# EAGLE design BMCOP V1.2 (EAGLE 8.6.0)
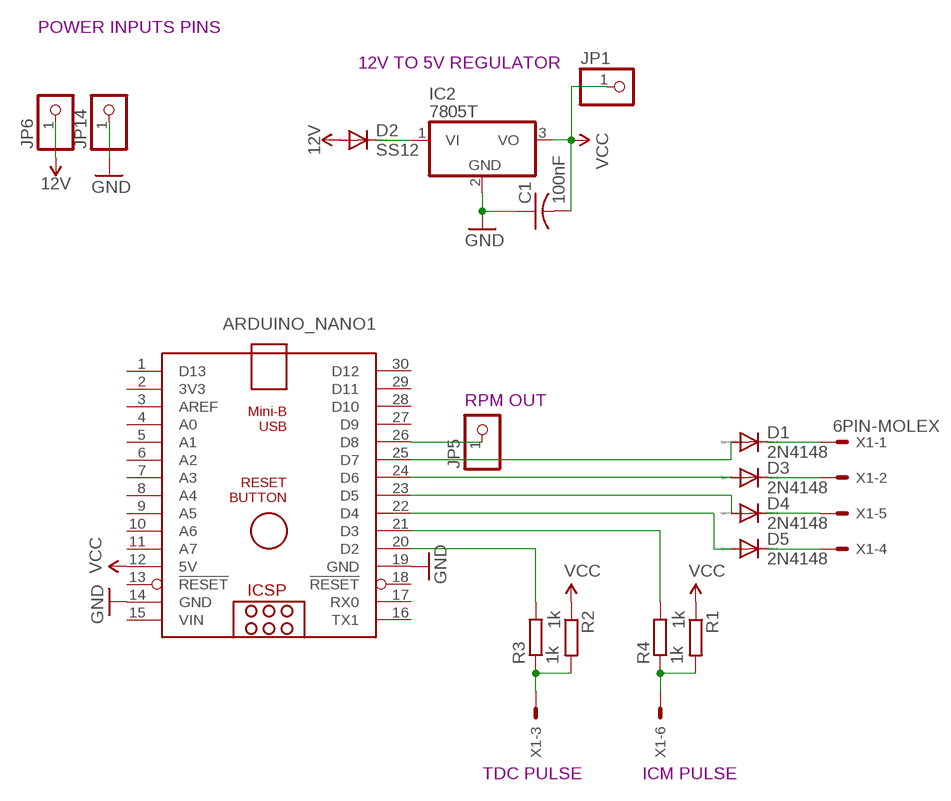
[diagram p0: schematic, sheet 1]

## Parts
ARDUINO_NANO1  ARDUINO_NANO  [ARDUINO_NANO]
C1  100nF  C-US025-024X044  [C025-024X044]
D1  2N4148  DIODE-D-7.5  [D-7.5]
D2  SS12  DIODE-D-7.5  [D-7.5]
D3  2N4148  DIODE-D-7.5  [D-7.5]
D4  2N4148  DIODE-D-7.5  [D-7.5]
D5  2N4148  DIODE-D-7.5  [D-7.5]
IC2  7805T  [TO220H]
JP1  PINHD-1X1  [1X01]
JP5  PINHD-1X1  [1X01]
JP6  PINHD-1X1  [1X01]
JP14  PINHD-1X1  [1X01]
R1  1k  R-EU_0204/7  [0204/7]
R2  1k  R-EU_0204/7  [0204/7]
R3  1k  R-EU_0204/7  [0204/7]
R4  1k  R-EU_0204/7  [0204/7]
X1  6PIN-MOLEX  [6PIN-MOLEX]

## Nets
12V: D2.A JP6.1
GND: ARDUINO_NANO1.14(GND) ARDUINO_NANO1.19(GND) C1.1 IC2.2(GND) JP14.1
N$1: ARDUINO_NANO1.25(D7) D1.A
N$2: ARDUINO_NANO1.24(D6) D3.A
N$3: ARDUINO_NANO1.23(D5) D4.A
N$4: ARDUINO_NANO1.22(D4) D5.A
N$5: D2.C IC2.1(VI)
N$8: ARDUINO_NANO1.26(D8) JP5.1
N$10: R1.2 R4.1 X1.6
N$11: ARDUINO_NANO1.21(D3) R4.2
N$14: ARDUINO_NANO1.20(D2) R3.2
N$21: D4.C X1.5
N$25: D1.C X1.1
N$26: D3.C X1.2
N$29: R2.2 R3.1 X1.3
N$31: D5.C X1.4
VCC: ARDUINO_NANO1.12(5V) C1.2 IC2.3(VO) JP1.1 R1.1 R2.1
Unconnected: ARDUINO_NANO1.1(D13) ARDUINO_NANO1.2(3V3) ARDUINO_NANO1.3(AREF) ARDUINO_NANO1.4(A0) ARDUINO_NANO1.5(A1) ARDUINO_NANO1.6(A2) ARDUINO_NANO1.7(A3) ARDUINO_NANO1.8(A4) ARDUINO_NANO1.9(A5) ARDUINO_NANO1.10(A6) ARDUINO_NANO1.11(A7) ARDUINO_NANO1.13(!RESET) ARDUINO_NANO1.16(TX1) ARDUINO_NANO1.17(RX0) ARDUINO_NANO1.18(!RESET) ARDUINO_NANO1.27(D9) ARDUINO_NANO1.28(D10) ARDUINO_NANO1.29(D11) ARDUINO_NANO1.30(D12)

## Notes on the sheet
- POWER INPUTS PINS
- 12V TO 5V REGULATOR
- RPM OUT
- TDC PULSE | ICM PULSE

## Power pins joined to a net without a drawn wire
VIN: ARDUINO_NANO1.15(VIN)

## Library data of the parts
ARDUINO_NANO1 = ArduinoNanoV30:ARDUINO_NANO: Arduino Nano V3.0 Overview: The Arduino Nano is a small, complete, and breadboard-friendly board based on the ATmega328 (Arduino Nano 3.x) or ATmega168 (Arduino Nano 2.x). It has more or less the same functionality of the Arduino Duemilanove, but in a different package. It lacks only a DC power jack, and works with a Mini-B USB cable instead of a standard one. The Nano was designed and is being produced by Gravitech. Specifications: Microcontroller Atmel ATmega168 or ATmega328 Operating Voltage (logic level) 5 V Input Voltage (recommended) 7-12 V Input Voltage (limits) 6-20 V Digital I/O Pins 14 (of which 6 provide PWM output) Analog Input Pins 8 DC Current per I/O Pin 40 mA Flash Memory 16 KB (ATmega168) or 32 KB (ATmega328) of which 2 KB used by bootloader SRAM 1 KB (ATmega168) or 2 KB (ATmega328) EEPROM 512 bytes (ATmega168) or 1 KB (ATmega328) Clock Speed 16 MHz Dimensions 0.73" x 1.70" Length 45 mm Width 18 mm Weigth 5 g Power: The Arduino Nano can be powered via the Mini-B USB connection, 6-20V unregulated external power supply (pin 30), or 5V regulated external power supply (pin 27). The power source is automatically selected to the highest voltage source. Memory: The ATmega168 has 16 KB of flash memory for storing code (of which 2 KB is used for the bootloader); the ATmega328 has 32 KB, (also with 2 KB used for the bootloader). The ATmega168 has 1 KB of SRAM and 512 bytes of EEPROM (which can be read and written with the EEPROM library); the ATmega328 has 2 KB of SRAM and 1 KB of EEPROM. Input and Output: Each of the 14 digital pins on the Nano can be used as an input or output, using pinMode(), digitalWrite(), and digitalRead() functions. They operate at 5 volts. Each pin can provide or receive a maximum of 40 mA and has an internal pull-up resistor (disconnected by default) of 20-50 kOhms. In addition, some pins have specialized functions. Visit Arduino - ArduinoBoardNano <https://www.arduino.cc/en/Main/ArduinoBoardNano>
C1 = resistor:C-US: CAPACITOR, American symbol
D1-D5 = diode:DIODE-: DIODE
IC2 = linear:78*: Positive VOLTAGE REGULATOR Source: http://cache.national.com/ds/LM/LM78L05.pdf http://www.fairchildsemi.com/ds/LM/LM7805.pdf
JP1 JP5 JP6 JP14 = pinhead_MOD:PINHD-1X1: PIN HEADER
R1-R4 = resistor:R-EU_: RESISTOR, European symbol
X1 = molex-custom:6PIN-MOLEX: Mini FIT connector 6 pol Source: http://www.molex.com

## Net classes
3 usbvcc: width 0.508 mm, drill 0.61 mm, clearance 0.254 mm

## Board
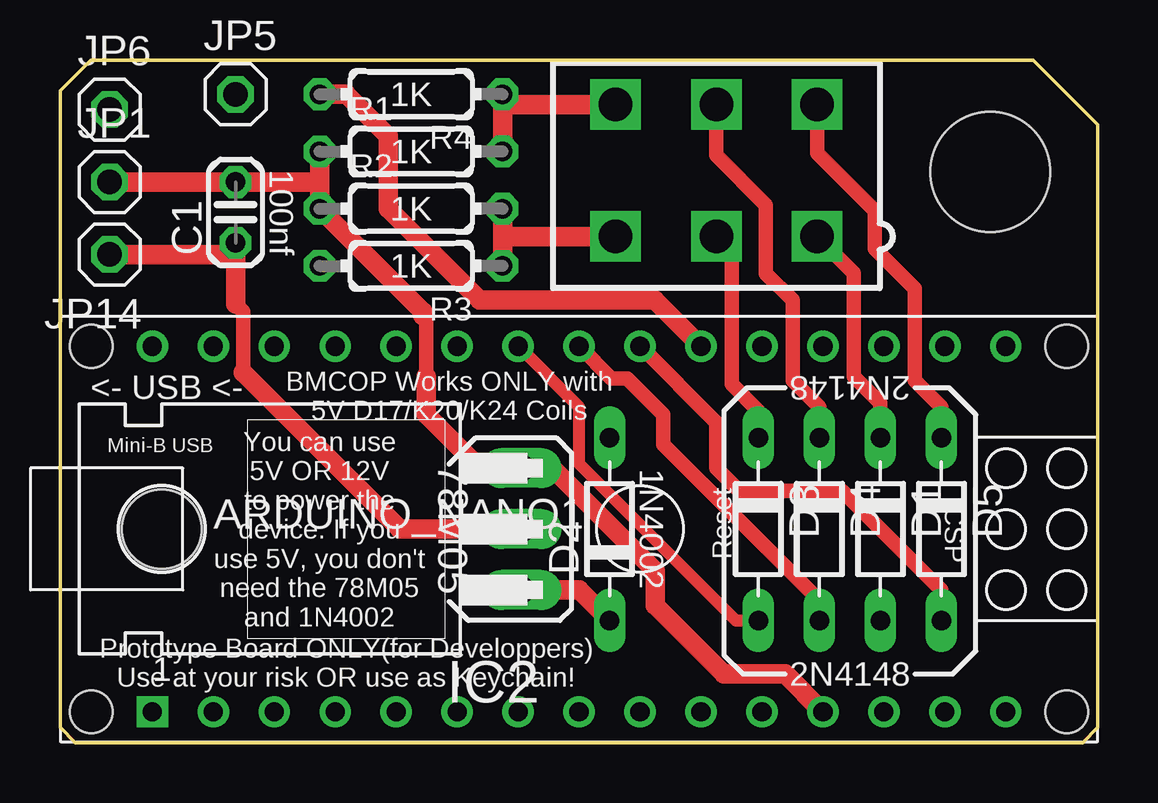
[diagram p1: board, top side]
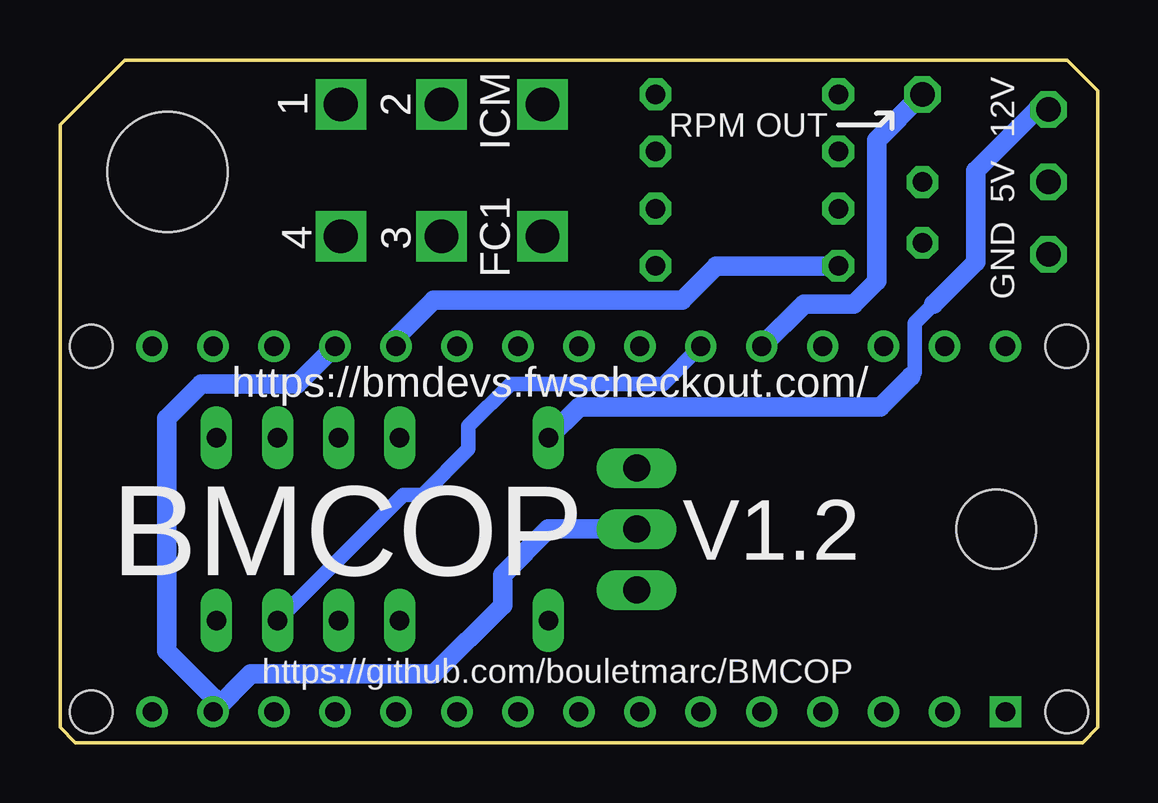
[diagram p2: board, bottom side, seen from below]

Size 43.25 x 28.46 mm. Coordinates in mm from the lower left corner, seen from the top.
Outline: 40.55,28.46 1.27,28.46 0,27.19 0,0.64 0.64,0 42.61,0 43.25,0.64 43.25,25.76 40.55,28.46
Copper layers (1*16): Top 0.035mm / dielectric 1.5mm / Bottom 0.035mm
Design rules "BMBurner_Rules *": minimum track width 10mil, minimum drill 12mil, track to track 10mil, track to pad 10mil, pad to pad 10mil, via to via 10mil, smd to smd 0mil, copper to edge 10mil, drill to drill 10mil, minimum pad ring 10mil, minimum via ring 6mil, stop-mask expansion 2mil, vias tented up to drill 25mil, thermal gap 10mil
Holes 5 mm at 38.76,23.79
tRestrict: area 36.8,21.9 to 40.8,25.9
bRestrict: area 36.8,21.9 to 40.8,25.9

### Footprints (pad centres in the part's own frame; a part is rotated, then mirrored left to right if it is on the bottom)
ARDUINO_NANO = drill 0.8 square: 1 -20.32,-7.62 | drill 0.8: 2 -17.78,-7.62; 3 -15.24,-7.62; 4 -12.7,-7.62; 5 -10.16,-7.62; 6 -7.62,-7.62; 7 -5.08,-7.62; 8 -2.54,-7.62; 9 0,-7.62; 10 2.54,-7.62; 11 5.08,-7.62; 12 7.62,-7.62; 13 10.16,-7.62; 14 12.7,-7.62; 15 15.24,-7.62; 16 15.24,7.62; 17 12.7,7.62; 18 10.16,7.62; 19 7.62,7.62; 20 5.08,7.62; 21 2.54,7.62; 22 0,7.62; 23 -2.54,7.62; 24 -5.08,7.62; 25 -7.62,7.62; 26 -10.16,7.62; 27 -12.7,7.62; 28 -15.24,7.62; 29 -17.78,7.62; 30 -20.32,7.62 | hole 1.778: -22.86,-7.62; -22.86,7.62; 17.78,7.62; 17.78,-7.62
C025-024X044 = drill 0.813 octagon: 1 -1.27,0; 2 1.27,0
D-7.5 = drill 0.813 long: A 3.81,0; C -3.81,0
TO220H = drill 1.118 long: 1 -2.54,-10.16; 2 0,-10.16; 3 2.54,-10.16 | hole 3.302: 0,4.826
1X01 = drill 1.016 octagon: 1 0,0
0204/7 = drill 0.813 octagon: 1 -3.81,0; 2 3.81,0
6PIN-MOLEX = drill 1.4 square: 1 4.2,-2.75; 2 0,-2.75; 3 -4.2,-2.75; 4 4.2,2.75; 5 0,2.75; 6 -4.2,2.75

### Placement (x,y rotation side)
ARDUINO_NANO1  24.17,8.9 0 top
C1  7.31,22.1 90 top
D1  34.19,8.9 270 top
D2  22.9,8.9 90 top
D3  29.1,8.9 270 top
D4  31.64,8.9 270 top
D5  36.73,8.9 270 top
IC2  9.06,8.9 90 top
JP1  2.07,23.37 0 top
JP5  7.31,27.03 0 top
JP6  2.07,26.39 0 top
JP14  2.07,20.35 180 top
R1  14.63,24.64 0 top
R2  14.63,22.26 0 top
R3  14.63,19.88 180 top
R4  14.63,27.03 180 top
X1  27.35,23.85 0 top

### Tracks (layer width: path | path; a pad name or v marks a point on that pad's centre or on a via)
12V
  Bottom 0.61: 6.84,18.29 7.63,17.49 7.63,15.42 7.79,15.26
  Bottom 0.813: JP6.1 2.54,26.39 5.09,23.85 5.09,20.03 6.84,18.29 | 7.79,15.26 9.06,13.99 21.62,13.99 D2.A
GND
  Top 0.61: 7.31,18.29 7.63,17.97 7.63,15.42
  Top 0.813: JP14.1 6.83,20.35 C1.1 7.31,18.29 | 7.63,15.42 14.15,8.9 IC2.2
  Bottom 0.813: IC2.2 22.9,8.9 24.8,7 24.8,5.72 27.67,2.86 35.29,2.86 ARDUINO_NANO1.14 36.87,1.89 38.8,3.82 38.8,13.52 37.37,14.95 33.37,14.95 ARDUINO_NANO1.19
N$1
  Bottom 0.61: D1.A 28.94,10.34 28.14,10.34 26.23,12.24 26.23,13.2 24.48,14.96 18.11,14.96 ARDUINO_NANO1.25
N$2
  Top 0.508: ARDUINO_NANO1.24 21.62,13.99 21.62,11.63 28.16,5.09 D3.A
N$3
  Top 0.61: ARDUINO_NANO1.23 22.97,15.18 23.64,15.18 25.14,13.67 25.14,12.43 31.64,5.93 D4.A
N$4
  Top 0.61: ARDUINO_NANO1.22 27.35,13.34 27.35,11.45 28.3,10.49 32.59,10.49 36.73,6.36 D5.A
N$5
  Top 0.813: IC2.1 21.63,6.36 D2.C
N$8
  Bottom 0.813: JP5.1 9.22,25.12 9.22,19.24 10.18,18.29 12.25,18.29 ARDUINO_NANO1.26
N$10
  Top 0.813: X1.6 18.87,26.6 R4.1 R1.2
N$11
  Top 0.813: R4.2 11.93,27.03 13.67,25.28 13.67,22.26 17.49,18.44 24.79,18.44 ARDUINO_NANO1.21
N$14
  Bottom 0.813: R3.2 15.9,19.88 17.33,18.44 27.67,18.44 29.25,16.86 ARDUINO_NANO1.20
N$21
  Top 0.61: X1.5 27.35,24.49 29.41,22.42 29.41,19.56 30.53,18.44 30.53,15.11 31.64,13.99 D4.C
N$25
  Top 0.61: X1.1 33.07,19.58 33.07,15.26 34.19,14.15 D1.C
N$26
  Top 0.61: X1.2 27.98,20.46 27.98,14.95 29.1,13.83 D3.C
N$29
  Top 0.813: X1.3 18.65,21.1 18.44,21.31 | 18.44,21.31 R2.2 | R3.1 18.44,21.31
N$31
  Top 0.61: X1.4 31.55,24.58 33.95,22.18 33.95,20.59 35.62,18.92 35.62,15.11 36.73,13.99 D5.C
VCC
  Top 0.61: 15.11,17.81 15.26,17.65 15.26,15.26
  Top 0.813: 10.82,23.53 R2.1 15.11,17.97 15.11,17.81 | 10.82,23.53 R1.1 | 10.82,23.53 10.66,23.37 C1.2 JP1.1 | ARDUINO_NANO1.12 30.21,2.86 27.67,2.86 24.8,5.72 24.8,7.16 20.52,11.44 IC2.3 17.49,11.44 15.26,13.67 15.26,15.26

### Text on the board
_tsilk: 1K | 1K | 100nf | 1K | 1K | 2N4148 | <- USB <- | BMCOP Works ONLY with / 5V D17/K20/K24 Coils | You can use / 5V OR 12V / to power the / device. If you / use 5V, you don't / need the 78M05 / and 1N4002 | 78M05 | 1N4002 | Prototype Board ONLY(for Developpers) / Use at your risk OR use as Keychain! | 2N4148
_bsilk: 12V | 2 | 1 | RPM OUT | ICM | 5V | GND | 3 | 4 | FC1 | https://bmdevs.fwscheckout.com/ | V1.2 | BMCOP | https://github.com/bouletmarc/BMCOP